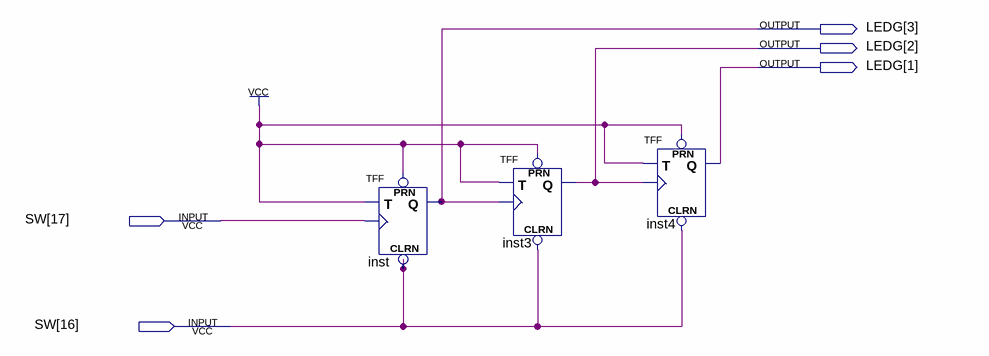
[diagram p0: schematic sheet]
// Quartus schematic StepperMotor1.bdf as structural Verilog: 3 symbols, 5 pins
module StepperMotor1 (
  input  [17:16] SW,
  output [3:1] LEDG
);

  TFF inst (.PRN(1'b1), .CLRN(SW[16]), .T(1'b1), .CLK(SW[17]), .Q(LEDG[3]));
  TFF inst3 (.PRN(1'b1), .CLRN(SW[16]), .T(1'b1), .CLK(LEDG[3]), .Q(LEDG[2]));
  TFF inst4 (.PRN(1'b1), .CLRN(SW[16]), .T(1'b1), .CLK(LEDG[2]), .Q(LEDG[1]));
endmodule
